# Altium schematic sheet KC_BaseBoard4CompareTest.SchDoc
size A4
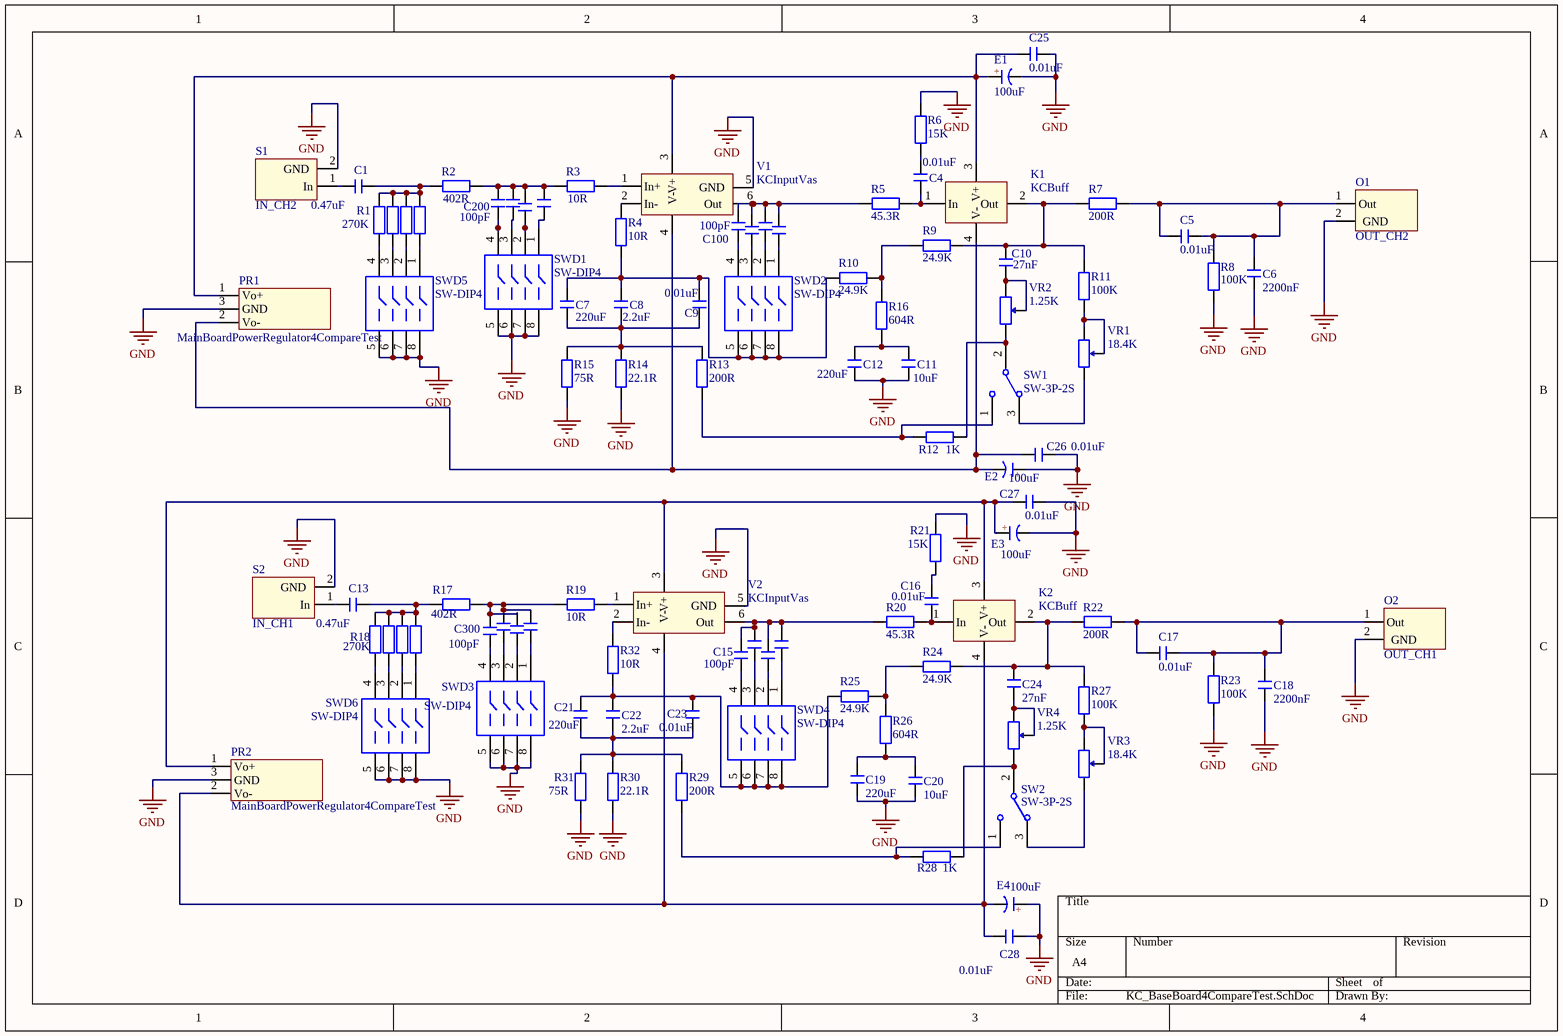
[diagram p0: KC_BaseBoard4CompareTest.SchDoc]

## Parts
C1  0.47uF  [CBB 50*30*30]
C4  0.01uF  [CBB 6.3*6.3*5]
C5  0.01uF  [CBB 6.3*6.3*5]
C6  2200nF  [CBB 6.3*6.3*5]
C7  220uF  [CBB 6.3*6.3*5]
C8  2.2uF  [CBB 6.3*6.3*5]
C9  0.01uF  [CBB 6.3*6.3*5]
C10  27nF  [CBB 6.3*6.3*5]
C11  10uF  [CBB 6.3*6.3*5]
C12  220uF  [CBB 6.3*6.3*5]
C13  0.47uF  [CBB 50*30*30]
C15  100pF  [CBB 6.3*6.3*5]
C16  0.01uF  [CBB 6.3*6.3*5]
C17  0.01uF  [CBB 6.3*6.3*5]
C18  2200nF  [CBB 6.3*6.3*5]
C19  220uF  [CBB 6.3*6.3*5]
C20  10uF  [CBB 6.3*6.3*5]
C21  220uF  [CBB 6.3*6.3*5]
C22  2.2uF  [CBB 6.3*6.3*5]
C23  0.01uF  [CBB 6.3*6.3*5]
C24  27nF  [CBB 6.3*6.3*5]
C25  0.01uF  [CBB 6.3*6.3*5]
C26  0.01uF  [CBB 6.3*6.3*5]
C27  0.01uF  [CBB 6.3*6.3*5]
C28  0.01uF  [CBB 6.3*6.3*5]
C100  100pF  [CBB 6.3*6.3*5]
C101  100pF  [CBB 6.3*6.3*5]  (value not drawn)
C102  100pF  [CBB 6.3*6.3*5]  (value not drawn)
C103  20pF  [CBB 6.3*6.3*5]  (value not drawn)
C200  100pF  [CBB 6.3*6.3*5]
C201  100pF  [CBB 6.3*6.3*5]  (value not drawn)
C202  100pF  [CBB 6.3*6.3*5]  (value not drawn)
C203  20pF  [CBB 6.3*6.3*5]  (value not drawn)
C300  100pF  [CBB 6.3*6.3*5]
C301  100pF  [CBB 6.3*6.3*5]  (value not drawn)
C302  100pF  [CBB 6.3*6.3*5]  (value not drawn)
C303  20pF  [CBB 6.3*6.3*5]  (value not drawn)
C401  100pF  [CBB 6.3*6.3*5]  (value not drawn)
C402  100pF  [CBB 6.3*6.3*5]  (value not drawn)
C403  20pF  [CBB 6.3*6.3*5]  (value not drawn)
E1  100uF  [CAP 5.0*10*20]
E2  100uF  [CAP 5.0*10*20]
E3  100uF  [CAP 5.0*10*20]
E4  100uF  [CAP 5.0*10*20]
K1  KCBuff  [KCBuff_M4]
K2  KCBuff  [KCBuff_M4]
O1  OUT_CH2  [Signal_Terminal]
O2  OUT_CH1  [Signal_Terminal]
PR1  MainBoardPowerRegulator4CompareTest  [KC_MBPowerReg4Compare]
PR2  MainBoardPowerRegulator4CompareTest  [KC_MBPowerReg4Compare]
R1  270K  [RS 1/2W]
R2  402R  [RS 1/2W]
R3  10R  [RS 1/2W]
R4  10R  [RS 1/2W]
R5  45.3R  [RS 1/2W]
R6  15K  [RS 1/2W]
R7  200R  [RS 1W]
R8  100K  [RS 1/2W]
R9  24.9K  [RS 1/2W]
R10  24.9K  [RS 1/2W]
R11  100K  [RS 1/2W]
R12  1K  [RS 1/2W]
R13  200R  [RS 1/2W]
R14  22.1R  [RS 1/2W]
R15  75R  [RS 1/2W]
R16  604R  [RS 1W]
R17  402R  [RS 1/2W]
R18  270K  [RS 1/2W]
R19  10R  [RS 1/2W]
R20  45.3R  [RS 1/2W]
R21  15K  [RS 1/2W]
R22  200R  [RS 1W]
R23  100K  [RS 1/2W]
R24  24.9K  [RS 1/2W]
R25  24.9K  [RS 1/2W]
R26  604R  [RS 1W]
R27  100K  [RS 1/2W]
R28  1K  [RS 1/2W]
R29  200R  [RS 1/2W]
R30  22.1R  [RS 1/2W]
R31  75R  [RS 1/2W]
R32  10R  [RS 1/2W]
R101  182K  [RS 1/2W]  (value not drawn)
R102  100K  [RS 1/2W]  (value not drawn)
R103  47K  [RS 1/2W]  (value not drawn)
R181  182K  [RS 1/2W]  (value not drawn)
R182  100K  [RS 1/2W]  (value not drawn)
R183  47K  [RS 1/2W]  (value not drawn)
S1  IN_CH2  [Signal_Terminal]
S2  IN_CH1  [Signal_Terminal]
SW1  SW-3P-2S  [SS-12D06]
SW2  SW-3P-2S  [SS-12D06]
SWD1  SW-DIP4  [DIP-8]
SWD2  SW-DIP4  [DIP-8]
SWD3  SW-DIP4  [DIP-8]
SWD4  SW-DIP4  [DIP-8]
SWD5  SW-DIP4  [DIP-8]
SWD6  SW-DIP4  [DIP-8]
V1  KCInputVas  [KCIn_VAS_M4]
V2  KCInputVas  [KCIn_VAS_M4]
VR1  18.4K  [RS 1/2W-VR]
VR2  1.25K  [RS 1/2W-VR]
VR3  18.4K  [RS 1/2W-VR]
VR4  1.25K  [RS 1/2W-VR]

## Nets
GND: C6.1 C11.1 C12.1 C18.2 C19.2 C20.2 C25.2 C26.2 C27.2 C28.2 E1.2(K) E2.1(A) E3.2(K) E4.1(A) O1.2(GND) O2.2(GND) PR1.3(GND) PR2.3(GND) R6.1 R8.1 R14.1 R15.1 R21.2 R23.2 R30.1 R31.1 S1.2(GND) S2.2(GND) SWD1.5 SWD1.6 SWD1.7 SWD1.8 SWD3.5 SWD3.6 SWD3.7 SWD3.8 SWD5.5 SWD5.6 SWD5.7 SWD5.8 SWD6.5 SWD6.6 SWD6.7 SWD6.8 V1.5(GND) V2.5(GND)
NetC1_1: C1.1 S1.1(In)
NetC1_2: C1.2 R1.2 R2.1 R101.2 R102.2 R103.2
NetC4_1: C4.1 K1.1(In) R5.1
NetC4_2: C4.2 R6.2
NetC5_1: C5.1 C5.2 C6.2 O1.1(Out) R7.2 R8.2
NetC7_1: C7.1 C8.1 C9.1 R13.2 R14.2 R15.2
NetC7_2: C7.2 C8.2 C9.2 R4.1 R10.2 SWD2.5 SWD2.6 SWD2.7 SWD2.8
NetC10_1: C10.1 VR2.1 VR2.3
NetC10_2: C10.2 K1.2(Out) R7.1 R9.1 R11.1
NetC11_2: C11.2 C12.2 R16.1
NetC13_1: C13.1 S2.1(In)
NetC13_2: C13.2 R17.1 R18.2 R181.2 R182.2 R183.2
NetC15_1: C15.1 SWD4.4
NetC15_2: C15.2 C401.2 C402.2 C403.2 R20.1 V2.6(Out)
NetC16_1: C16.1 K2.1(In) R20.2
NetC16_2: C16.2 R21.1
NetC17_1: C17.1 C17.2 C18.1 O2.1(Out) R22.1 R23.1
NetC19_1: C19.1 C20.1 R26.1
NetC21_1: C21.1 C22.1 C23.1 R25.1 R32.1 SWD4.5 SWD4.6 SWD4.7 SWD4.8
NetC21_2: C21.2 C22.2 C23.2 R29.2 R30.2 R31.2
NetC24_1: C24.1 K2.2(Out) R22.2 R24.2 R27.1
NetC24_2: C24.2 VR4.1 VR4.3
NetC25_1: C25.1 E1.1(A) K1.3(V+) PR1.1(Vo+) V1.3(V+)
NetC26_1: C26.1 E2.2(K) K1.4(V-) PR1.2(Vo-) V1.4(V-)
NetC27_1: C27.1 E3.1(A) K2.3(V+) PR2.1(Vo+) V2.3(V+)
NetC28_1: C28.1 E4.2(K) K2.4(V-) PR2.2(Vo-) V2.4(V-)
NetC100_1: C100.1 SWD2.4
NetC100_2: C100.2 C101.2 C102.2 C103.2 R5.2 V1.6(Out)
NetC101_1: C101.1 SWD2.3
NetC102_1: C102.1 SWD2.2
NetC103_1: C103.1 SWD2.1
NetC200_1: C200.1 SWD1.4
NetC200_2: C200.2 C201.2 C202.2 C203.2 R2.2 R3.2
NetC201_1: C201.1 SWD1.3
NetC202_1: C202.1 SWD1.2
NetC203_1: C203.1 SWD1.1
NetC300_1: C300.1 SWD3.4
NetC300_2: C300.2 C301.2 C302.2 C303.2 R17.2 R19.1
NetC301_1: C301.1 SWD3.3
NetC302_1: C302.1 SWD3.2
NetC303_1: C303.1 SWD3.1
NetC401_1: C401.1 SWD4.3
NetC402_1: C402.1 SWD4.2
NetC403_1: C403.1 SWD4.1
NetR1_1: R1.1 SWD5.4
NetR3_1: R3.1 V1.1(In+)
NetR4_2: R4.2 V1.2(In-)
NetR9_2: R9.2 R10.1 R16.2
NetR11_2: R11.2 VR1.1 VR1.3
NetR12_1: R12.1 R13.1 SW1.1
NetR12_2: R12.2 SW1.2 VR2.2
NetR18_1: R18.1 SWD6.4
NetR19_2: R19.2 V2.1(In+)
NetR24_1: R24.1 R25.2 R26.2
NetR27_2: R27.2 VR3.1 VR3.3
NetR28_1: R28.1 R29.1 SW2.1
NetR28_2: R28.2 SW2.2 VR4.2
NetR32_2: R32.2 V2.2(In-)
NetR101_1: R101.1 SWD5.3
NetR102_1: R102.1 SWD5.2
NetR103_1: R103.1 SWD5.1
NetR181_1: R181.1 SWD6.3
NetR182_1: R182.1 SWD6.2
NetR183_1: R183.1 SWD6.1
NetSW1_3: SW1.3 VR1.2
NetSW2_3: SW2.3 VR3.2

## Notes on the sheet
- (in symbol C-CAP) +

## Library data of the parts
C1 C4-C13 C15-C28 C100-C103 C200-C203 C300-C303 C401-C403 = C-CBB: CBB电容; 版权归属: 源创客; BOM名称: CBB电容; 学习资源: www.ooocke.com
E1-E4 = C-CAP: 直插电解电容; 版权归属: 源创客; BOM名称: 直插电解电容; 学习资源: www.ooocke.com
K1 K2 = KCBuff: King Cello Buffer Stage
O1 O2 = Signal_Out: Signal Out
PR1 PR2 = MainBoardPowerRegulator4CompareTest: King Cello Compare Test Power
R1-R32 R101-R103 R181-R183 = R-CRR: 直插色环电阻; BOM名称: 色环电阻; 版权归属: 源创客; 学习资源: www.ooocke.com
S1 S2 = Signal_In: Signal In
SW1 SW2 = SW-3P-2S: 3 Pin 2 Switch
SWD1-SWD6 = SW-DIP4: DIP Switch; Published: 24-Mar-1999; LatestRevisionDate: 17-Jul-2002; LatestRevisionNote: Re-released for DXP Platform.; PackageReference: DIP-8; Publisher: Altium Limited
V1 V2 = KCInputVas: King Cello Input Stage and VAS
VR1-VR4 = VR-W: 直插可调电阻-顶调